# Altium schematic sheet FPGA_Stratix_672_SmartPack.SchDoc: FPGA Stratix 672 SmartPack Example
size B; Author: BJ; Organization: Altium Limited; Address1: L3, 12a Rodborough Rd; Address2: Frenchs Forest; Address3: NSW; Address4: Australia 2086; DocumentNumber: 1; Revision: 0; SheetNumber: 1; SheetTotal: 2
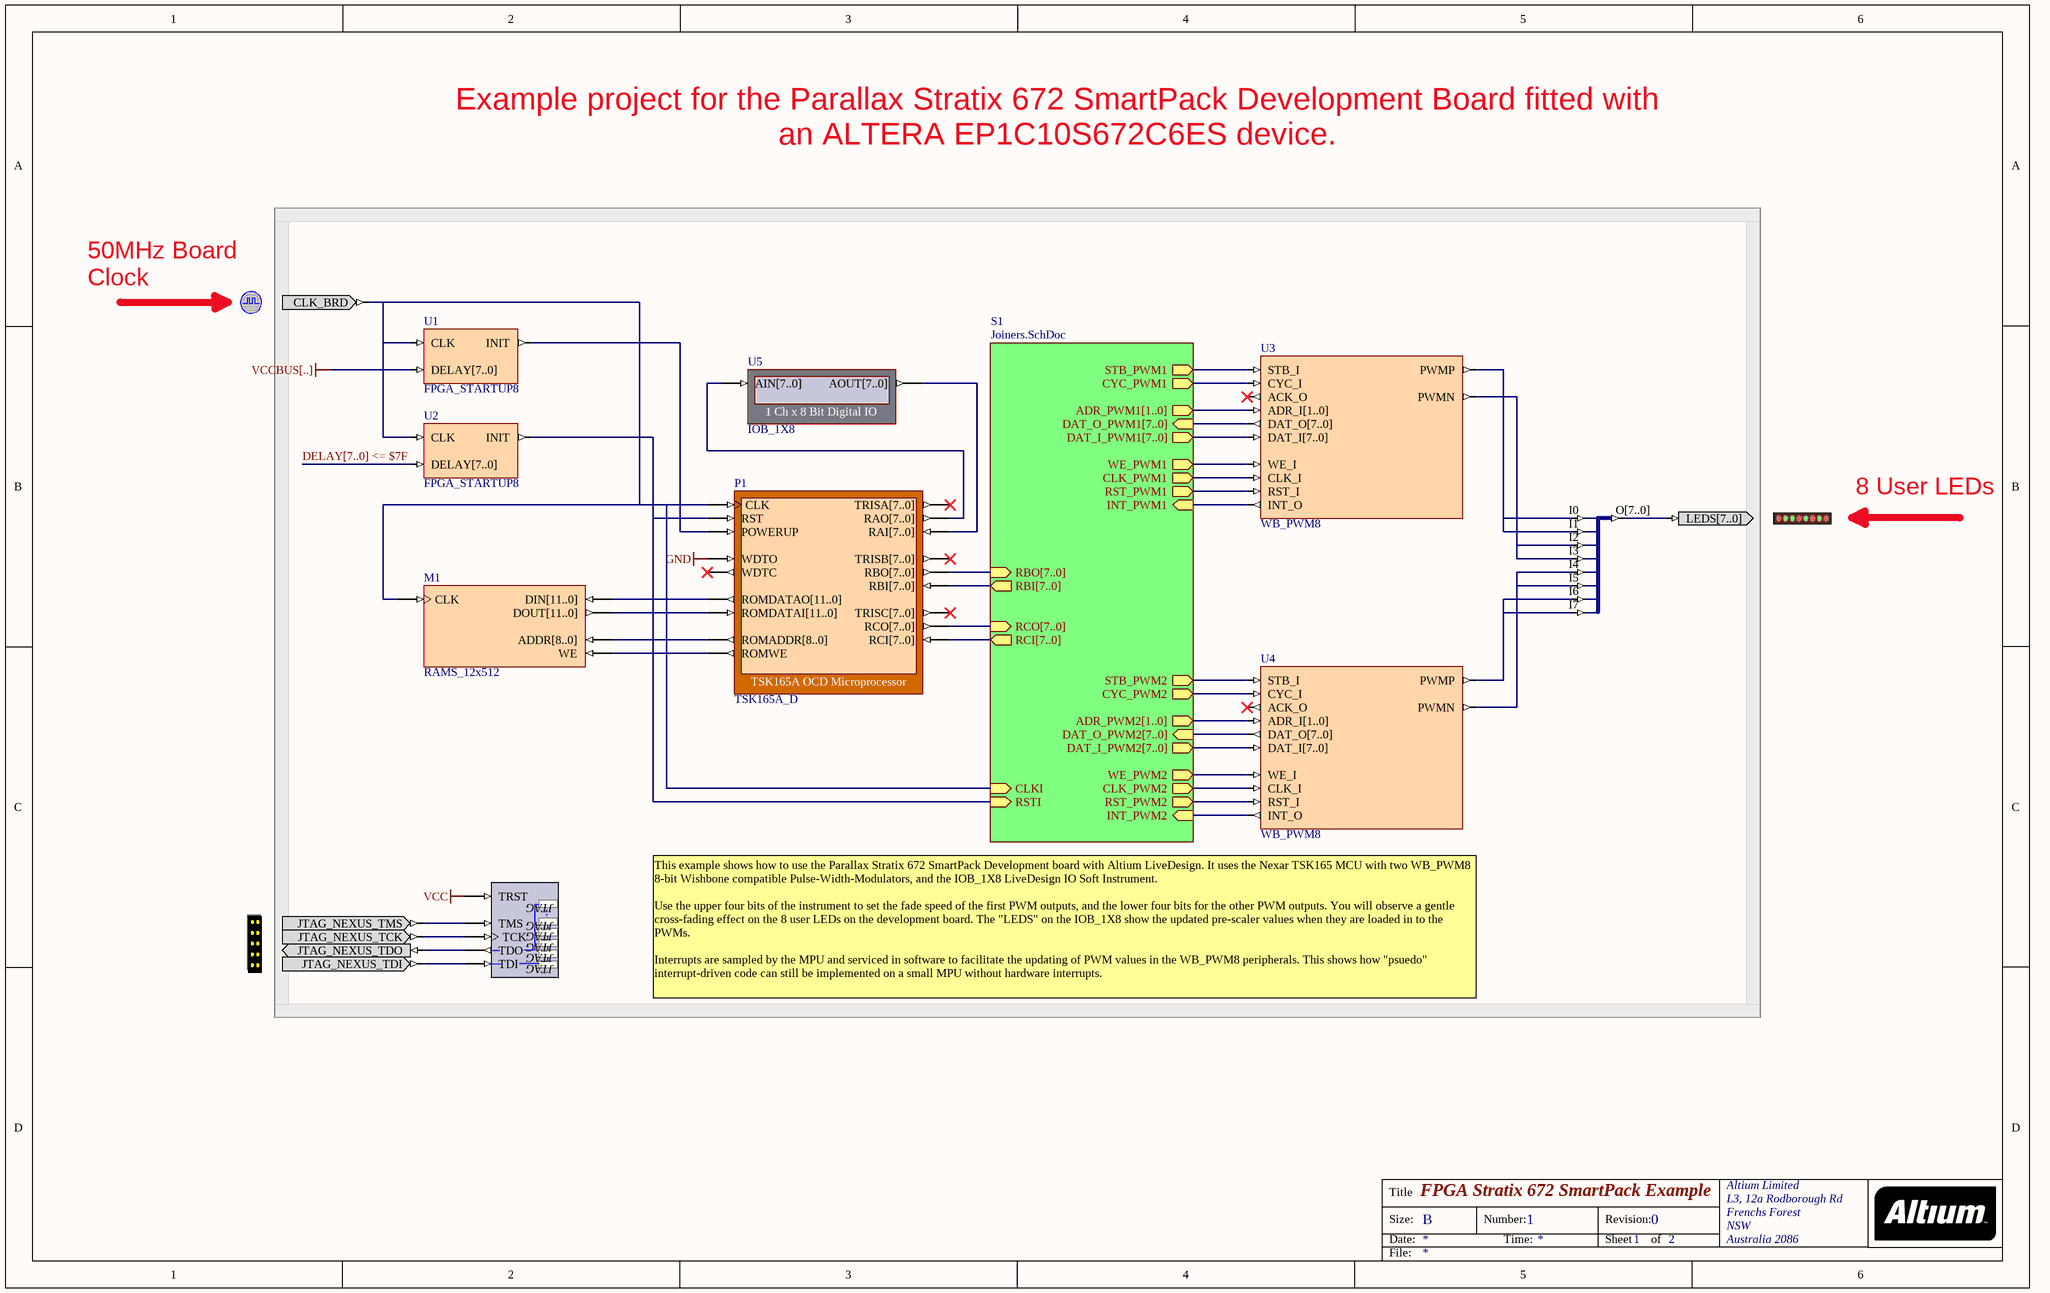
[diagram p0: FPGA_Stratix_672_SmartPack.SchDoc]

## Parts
(Parts that share a designator on the sheet are numbered #1, #2 ... from top to bottom, then left to right.)
?#1  CLOCK_BOARD  (value not drawn)
?#2  LED  (value not drawn)
?#3  NEXUS_JTAG_CONNECTOR  (value not drawn)
J5  J8S_8B  (value not drawn)
M1  RAMS_12x512
NEXUS_JTAG_PORT  NEXUS_JTAG_PORT  (value not drawn)
P1  TSK165A_D
U1  FPGA_STARTUP8
U2  FPGA_STARTUP8
U3  WB_PWM8
U4  WB_PWM8
U5  IOB_1X8

## Sub-sheets
S1 = Joiners.SchDoc: STB_PWM1 (out), CYC_PWM1 (out), ADR_PWM1[1..0] (out), DAT_O_PWM1[7..0] (in), DAT_I_PWM1[7..0] (out), WE_PWM1 (out), CLK_PWM1 (out), RST_PWM1 (out), INT_PWM1 (in), RSTI (in), CLKI (in), RCI[7..0] (out), RCO[7..0] (in), RBI[7..0] (out), RBO[7..0] (in), STB_PWM2 (out), CYC_PWM2 (out), ADR_PWM2[1..0] (out), DAT_O_PWM2[7..0] (in), DAT_I_PWM2[7..0] (out), WE_PWM2 (out), CLK_PWM2 (out), RST_PWM2 (out), INT_PWM2 (in)

## Nets
GND: P1.WDTO
VCC: NEXUS_JTAG_PORT.TRST
VCCBUS[..]: U1.DELAY[7..0]
DELAY[7..0] <= $7F: U2.DELAY[7..0]
Net?#1_CLK_BRD: ?#1.CLK_BRD M1.CLK P1.CLK U1.CLK U2.CLK ; sheet S1/CLKI
Net?#2_LEDS[7..0]: ?#2.LEDS[7..0] J5.O[7..0]
Net?#3_JTAG_NEXUS_TCK: ?#3.JTAG_NEXUS_TCK NEXUS_JTAG_PORT.TCK
Net?#3_JTAG_NEXUS_TDI: ?#3.JTAG_NEXUS_TDI NEXUS_JTAG_PORT.TDI
Net?#3_JTAG_NEXUS_TDO: ?#3.JTAG_NEXUS_TDO NEXUS_JTAG_PORT.TDO
Net?#3_JTAG_NEXUS_TMS: ?#3.JTAG_NEXUS_TMS NEXUS_JTAG_PORT.TMS
NetJ5_I0: J5.I0 J5.I1 U3.PWMP
NetJ5_I2: J5.I2 J5.I3 U3.PWMN
NetJ5_I4: J5.I4 J5.I5 U4.PWMN
NetJ5_I6: J5.I6 J5.I7 U4.PWMP
NetM1_ADDR[8..0]: M1.ADDR[8..0] P1.ROMADDR[8..0]
NetM1_DIN[11..0]: M1.DIN[11..0] P1.ROMDATAO[11..0]
NetM1_DOUT[11..0]: M1.DOUT[11..0] P1.ROMDATAI[11..0]
NetM1_WE: M1.WE P1.ROMWE
NetP1_POWERUP: P1.POWERUP U1.INIT
NetP1_RAI[7..0]: P1.RAI[7..0] U5.AOUT[7..0]
NetP1_RAO[7..0]: P1.RAO[7..0] U5.AIN[7..0]
NetP1_RBI[7..0]: P1.RBI[7..0] ; sheet S1/RBI[7..0]
NetP1_RBO[7..0]: P1.RBO[7..0] ; sheet S1/RBO[7..0]
NetP1_RCI[7..0]: P1.RCI[7..0] ; sheet S1/RCI[7..0]
NetP1_RCO[7..0]: P1.RCO[7..0] ; sheet S1/RCO[7..0]
NetP1_RST: P1.RST U2.INIT ; sheet S1/RSTI
NetU3_ADR_I[1..0]: U3.ADR_I[1..0] ; sheet S1/ADR_PWM1[1..0]
NetU3_CLK_I: U3.CLK_I ; sheet S1/CLK_PWM1
NetU3_CYC_I: U3.CYC_I ; sheet S1/CYC_PWM1
NetU3_DAT_I[7..0]: U3.DAT_I[7..0] ; sheet S1/DAT_I_PWM1[7..0]
NetU3_DAT_O[7..0]: U3.DAT_O[7..0] ; sheet S1/DAT_O_PWM1[7..0]
NetU3_INT_O: U3.INT_O ; sheet S1/INT_PWM1
NetU3_RST_I: U3.RST_I ; sheet S1/RST_PWM1
NetU3_STB_I: U3.STB_I ; sheet S1/STB_PWM1
NetU3_WE_I: U3.WE_I ; sheet S1/WE_PWM1
NetU4_ADR_I[1..0]: U4.ADR_I[1..0] ; sheet S1/ADR_PWM2[1..0]
NetU4_CLK_I: U4.CLK_I ; sheet S1/CLK_PWM2
NetU4_CYC_I: U4.CYC_I ; sheet S1/CYC_PWM2
NetU4_DAT_I[7..0]: U4.DAT_I[7..0] ; sheet S1/DAT_I_PWM2[7..0]
NetU4_DAT_O[7..0]: U4.DAT_O[7..0] ; sheet S1/DAT_O_PWM2[7..0]
NetU4_INT_O: U4.INT_O ; sheet S1/INT_PWM2
NetU4_RST_I: U4.RST_I ; sheet S1/RST_PWM2
NetU4_STB_I: U4.STB_I ; sheet S1/STB_PWM2
NetU4_WE_I: U4.WE_I ; sheet S1/WE_PWM2

Not connected (* = marked no-connect by the designer): P1 TRISA[7..0]* TRISB[7..0]* TRISC[7..0]* WDTC*; U3 ACK_O*; U4 ACK_O*

## Buses and harness runs
bus DELAY[7..0] <= $7F

## Notes on the sheet
- Example project for the Parallax Stratix 672 SmartPack Development Board fitted with an ALTERA EP1C10S672C6ES device.
- 50MHz Board Clock
- 8 User LEDs
- (near U4) This example shows how to use the Parallax Stratix 672 SmartPack Development board with Altium LiveDesign. It uses the Nexar TSK165 MCU with two WB_PWM8 8-bit Wishbone compatible Pulse-Width-Modulators, and the IOB_1X8 LiveDesign IO Soft Instrument.
  Use the upper four bits of the instrument to set the fade speed of the first PWM outputs, and the lower four bits for the other PWM outputs. You will observe a gentle cross-fading effect on the 8 user LEDs on the development board. The "LEDS" on the IOB_1X8 show the updated pre-scaler values when they are loaded in to the PWMs.
  Interrupts are sampled by the MPU and serviced in software to facilitate the updating of PWM values in the WB_PWM8 peripherals. This shows how "psuedo" interrupt-driven code can still be implemented on a small MPU without hardware interrupts.
- Title
- Size:
- Date:
- B
- Number:
- Time:
- Revision:
- Sheet
- of
- File:
- (in symbol NEXUS_JTAG_PORT) .

## Library data of the parts
?#1 = CLOCK_BOARD: Global System Clock Supply; PortComponent: True; Published: 19-Nov-2003; Publisher: Altium Limited; HelpURL: TR0102 NanoBoard Technical Reference Manual - NB1.pdf#page=29
?#2 = LED: 8-Way LEDS; PortComponent: True; Published: 19-Nov-2003; Publisher: Altium Limited; HelpURL: TR0102 NanoBoard Technical Reference Manual - NB1.pdf#page=41
?#3 = NEXUS_JTAG_CONNECTOR: JTAG Port; PortComponent: True; Published: 19-Nov-2003; Publisher: Altium Limited; HelpURL: TR0102 NanoBoard Technical Reference Manual - NB1.pdf#page=33
J5 = J8S_8B: 8 Single pin inputs to single 8-Bit output bus; FunctionalClass: Bus Joiner; PortSize: 8; ArchiveName: GENERIC; VHDLIB_SIM: GENERIC_LIB; Published: 29-Jan-2004; Publisher: Altium Limited; LastRevisionNo: 1.00.00; HelpURL: CR0118 FPGA Generic Library Guide.pdf#page=305; ComponentLink1URL: CR0126 FPGA Bus Joiner Resource Usage.pdf#page=28; ComponentLink1Description: Core &Resource Usage
M1 = RAMS_12x512: Single Port RAM; Memory_Depth: 512; Memory_Type: RAM_SinglePortBlock; Memory_Width: 12; Memory_ClockEdge: Rising; Nexus_Core: Memory_Program; Memory_EnablePin: False; Published: 11/10/2004; Publisher: Altium Hobart Technology Center; Memory_ByteWrites: False
NEXUS_JTAG_PORT = NEXUS_JTAG_PORT: Soft Nexus-Chain Connector; NEXUS_JTAG_CONNECTOR: True; FunctionalClass: JTAG; Published: 29-Jan-2004; Publisher: Altium Limited; LastRevisionNo: 1.00.00; HelpURL: CR0118 FPGA Generic Library Guide.pdf#page=399
P1 = TSK165A_D: TSK165A OCD Microprocessor; NEXUS_CORE: Processor_OCDS; NEXUS_JTAG_DEVICE: True; NEXUS_JTAG_ORDER: 0; ChildModel1: TSK165A_D_RAM32X8; ChildCore1: M1; Published: 17-Nov-2004; Publisher: Altium Limited; ComponentLink1Description: Core &Resource Usage; ComponentLink1URL: CR0140 FPGA Processor Resource Usage.pdf#page=11; HelpURL: CR0114 TSK165x RISC MCU.pdf#page=3; LastRevisionNo: 1.00.00; ComponentLink2Description: Embedded &Tools Guide; ComponentLink2URL: GU0108 Using the TSK165x Embedded Tools.pdf; ComponentLink3Description: Embedded T&echnical References; ComponentLink3URL: TR0106 TSK165x Embedded Tools Reference.pdf
U1 U2 = FPGA_STARTUP8: FPGA Startup With 8 Bit Delay; Published: 9-Dec-2004; Publisher: Altium Limited; HelpURL: CR0119 FPGA_STARTUPx Powerup Delay Unit.pdf#page=2; LastRevisionNo: 1.00.00; ComponentLink1Description: Core &Resource Usage; ComponentLink1URL: CR0139 FPGA Peripheral Resource Usage.pdf#page=9
U3 U4 = WB_PWM8: Pulse Width Modulation Controller Wishbone; ComponentLink1Description: Core &Resource Usage; ComponentLink1URL: CR0139 FPGA Peripheral Resource Usage.pdf; HelpURL: CR0155 WB_PWM8 Pulse Width Modulation Controller.pdf; LastRevisionNo: 1.00.00; Published: 9-Mar-2005; Publisher: Altium Limited
U5 = IOB_1X8: 1 Ch x 8 Bit Digital IO; NEXUS_CORE: Instrument; NEXUS_JTAG_DEVICE: True; NEXUS_JTAG_ORDER: 0; Published: 3-Nov-2004; Publisher: Altium Limited; LastRevisionNo: 1.00.00; HelpURL: CR0102 IOB_x Digital IO Module.pdf#page=2; ComponentLink1URL: CR0134 FPGA Instrument Resource Usage.pdf#page=4; ComponentLink1Description: Core &Resource Usage